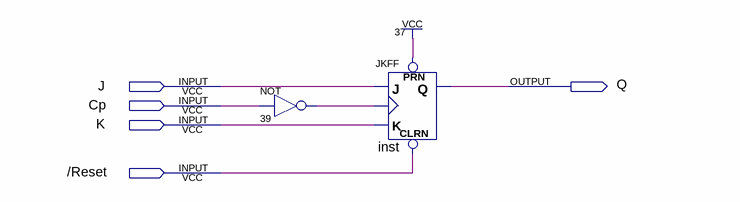
[diagram p0: schematic sheet]
// Quartus schematic jk_ff.bdf as structural Verilog: 2 symbols, 5 pins
module jk_ff (
  input  J,
  input  Cp,
  input  K,
  input  \/Reset ,
  output Q
);

  wire n39_out;

  not u_39 (n39_out, Cp);
  JKFF inst (.PRN(1'b1), .CLRN(\/Reset ), .K(K), .J(J), .CLK(n39_out), .Q(Q));
endmodule
